# Altium project Leningrad.PrjPcb (part 2 of 2)

## Sheet MemoryControl.SchDoc
size A4
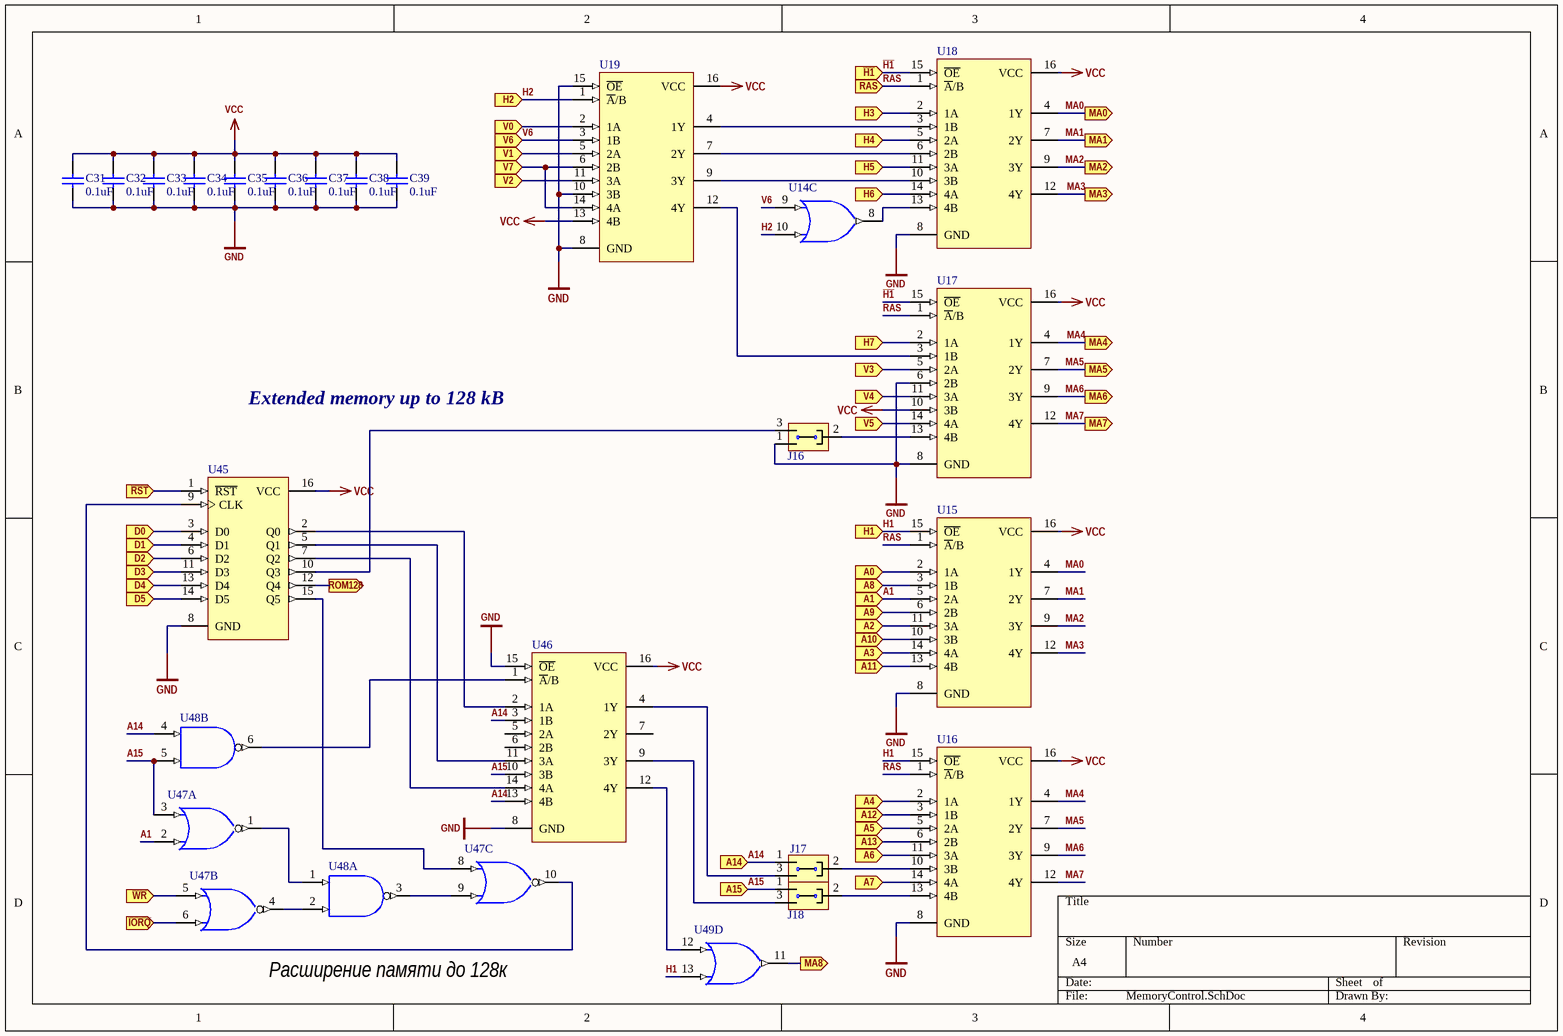
[diagram p6: MemoryControl.SchDoc]

### Parts
C31  value 0.1uF  [RAD-0.3]  (hidden comment: Cap)
C32  value 0.1uF  [RAD-0.3]  (hidden comment: Cap)
C33  value 0.1uF  [RAD-0.3]  (hidden comment: Cap)
C34  value 0.1uF  [RAD-0.3]  (hidden comment: Cap)
C35  value 0.1uF  [RAD-0.3]  (hidden comment: Cap)
C36  value 0.1uF  [RAD-0.3]  (hidden comment: Cap)
C37  value 0.1uF  [RAD-0.3]  (hidden comment: Cap)
C38  value 0.1uF  [RAD-0.3]  (hidden comment: Cap)
C39  value 0.1uF  [RAD-0.3]  (hidden comment: Cap)
J16  Jump3  [MHDR1X3]  (value not drawn)
J17  Jump3  [MHDR1X3]  (value not drawn)
J18  Jump3  [MHDR1X3]  (value not drawn)
U14  (no value)  [N014]  (part C of 4)
U15  (no value)  [N016]
U16  (no value)  [N016]
U17  (no value)  [N016]
U18  (no value)  [N016]
U19  (no value)  [N016]
U45  SN74HC174N  [N016]  (value not drawn)
U46  SN74HC257N  [N016]  (value not drawn)
U47  SN74HC02N  [N014]  (value not drawn)  (parts A,B,C of 4)
U48  SN74HC00N  [N014]  (value not drawn)  (parts A,B of 4)
U49  SN74HC32N  [N014]  (value not drawn)  (part D of 4)

### Ports
A0 (in), A1 (in), A2 (in), A3 (in), A4 (in), A5 (in), A6 (in), A7 (in), A8 (in), A9 (in), A10 (in), A11 (in), A12 (in), A13 (in), A14 (in), A15 (in), D0 (in), D1 (in), D2 (in), D3 (in), D4 (in), D5 (in), H1 (in), H2 (in), H3 (in), H4 (in), H5 (in), H6 (in), H7 (in), MA0 (out), MA1 (out), MA2 (out), MA3 (out), MA4 (out), MA5 (out), MA6 (out), MA7 (out), MA8 (out), RAS (in), ROM128 (out), V0 (in), V1 (in), V2 (in), V3 (in), V4 (in), V5 (in), V6 (in), V7 (in), ~{H1} (in), ~{IORQ} (in), ~{RST} (in), ~{WR} (in)

### Nets
GND: C31.1 C32.1 C33.1 C34.1 C35.1 C36.1 C37.1 C38.1 C39.1 J16.1 U14.7(GND) U15.8(GND) U16.8(GND) U17.6(2B) U17.8(GND) U18.8(GND) U19.8(GND) U19.10(3B) U19.15(~{OE}) U45.8(GND) U46.8(GND) U46.15(~{OE}) U47.7(GND) U48.7(GND) U49.7(GND)
VCC: C31.2 C32.2 C33.2 C34.2 C35.2 C36.2 C37.2 C38.2 C39.2 U14.14(VCC) U15.16(VCC) U16.16(VCC) U17.10(3B) U17.16(VCC) U18.16(VCC) U19.13(4B) U19.16(VCC) U45.16(VCC) U46.16(VCC) U47.14(VCC) U48.14(VCC) U49.14(VCC)
A0: U15.2(1A) ; port A0
A1: U15.5(2A) U47.2(A) ; port A1
A2: U15.11(3A) ; port A2
A3: U15.14(4A) ; port A3
A4: U16.2(1A) ; port A4
A5: U16.5(2A) ; port A5
A6: U16.11(3A) ; port A6
A7: U16.14(4A) ; port A7
A8: U15.3(1B) ; port A8
A9: U15.6(2B) ; port A9
A10: U15.10(3B) ; port A10
A11: U15.13(4B) ; port A11
A12: U16.3(1B) ; port A12
A13: U16.6(2B) ; port A13
A14: J17.1 U46.3(1B) U46.13(4B) U48.4(A) ; port A14
A15: J18.1 U46.10(3B) U47.3(B) U48.5(B) ; port A15
D0: U45.3(D0) ; port D0
D1: U45.4(D1) ; port D1
D2: U45.6(D2) ; port D2
D3: U45.11(D3) ; port D3
D4: U45.13(D4) ; port D4
D5: U45.14(D5) ; port D5
H1: U15.15(~{OE}) U16.15(~{OE}) U49.13(B) ; port H1
H2: U14.10(B) U19.1(~{A}/B) ; port H2
H5: U18.11(3A) ; port H5
~{H1}: U17.15(~{OE}) U18.15(~{OE}) ; port ~{H1}
MA0: U15.4(1Y) U18.4(1Y) ; port MA0
MA1: U15.7(2Y) U18.7(2Y) ; port MA1
MA2: U15.9(3Y) U18.9(3Y) ; port MA2
MA3: U15.12(4Y) U18.12(4Y) ; port MA3
MA4: U16.4(1Y) U17.4(1Y) ; port MA4
MA5: U16.7(2Y) U17.7(2Y) ; port MA5
MA6: U16.9(3Y) U17.9(3Y) ; port MA6
MA7: U16.12(4Y) U17.12(4Y) ; port MA7
MA8: U49.11(Y) ; port MA8
RAS: U15.1(~{A}/B) U16.1(~{A}/B) U17.1(~{A}/B) U18.1(~{A}/B) ; port RAS
V4: U17.11(3A) ; port V4
V5: U17.14(4A) ; port V5
V6: U14.9(A) U19.3(1B) ; port V6
~{WR}: U47.5(A) ; port ~{WR}
NetC1_1: U45.1(~{RST}) ; port ~{RST}
NetJ14_2: U47.6(B) ; port ~{IORQ}
NetJ16_2: J16.2 U17.13(4B)
NetJ16_3: J16.3 U45.10(Q3)
NetJ17_2: J17.2 U16.10(3B)
NetJ17_3: J17.3 U46.4(1Y)
NetJ18_2: J18.2 U16.13(4B)
NetJ18_3: J18.3 U46.9(3Y)
NetJ27_1: U17.2(1A) ; port H7
NetU3_7: U18.2(1A) ; port H3
NetU4_3: U18.5(2A) ; port H4
NetU4_6: U18.14(4A) ; port H6
NetU5_2: U19.5(2A) ; port V1
NetU5_3: U19.2(1A) ; port V0
NetU5_6: U19.11(3A) ; port V2
NetU5_7: U17.5(2A) ; port V3
NetU6_7: U19.6(2B) U19.14(4A) ; port V7
NetU14_8: U14.8(Y) U18.13(4B)
NetU17_3: U17.3(1B) U19.12(4Y)
NetU18_3: U18.3(1B) U19.4(1Y)
NetU18_6: U18.6(2B) U19.7(2Y)
NetU18_10: U18.10(3B) U19.9(3Y)
NetU34_9: U45.12(Q4) ; port ROM128
NetU45_2: U45.2(Q0) U46.2(1A)
NetU45_5: U45.5(Q1) U46.11(3A)
NetU45_7: U45.7(Q2) U46.14(4A)
NetU45_9: U45.9(CLK) U47.10(Y)
NetU45_15: U45.15(Q5) U47.8(A)
NetU46_1: U46.1(~{A}/B) U48.6(Y)
NetU46_12: U46.12(4Y) U49.12(A)
NetU47_1: U47.1(Y) U48.1(A)
NetU47_4: U47.4(Y) U48.2(B)
NetU47_9: U47.9(B) U48.3(Y)

Not connected (* = marked no-connect by the designer): U46 5(2A) 6(2B) 7(2Y)

### Notes on the sheet
- Extended memory up to 128 kB
- Расширение памяти до 128к

### Library data of the parts
C31-C39 = Cap: Capacitor; Published: 8-Jun-2000; LatestRevisionDate: 17-Jul-2002; LatestRevisionNote: Re-released for DXP Platform.; PackageReference: RAD-0.3; Publisher: Altium Limited; PackageDescription: Radial Cap, Thru-Hole; 2 Leads; 0.3 in Pin Spacing
U14 U49 = SN74HC32N: Quadruple 2-Input Positive-OR Gate; Published: 8-Jun-2000; LatestRevisionDate: 04-Mar-2005; LatestRevisionNote: Stylized 3D Model Added.; DatasheetVersion: May-1997; PackageVersion: Oct-1995; PackageReference: N014; Publisher: Altium Limited; PackageDescription: DIP; 14 Leads; Row Spacing 7.62 mm; Pitch 2.54 mm; ComponentLink1Description: Manufacturer Link; ComponentLink1URL: http://www.ti.com/; ComponentLink2Description: Datasheet; ComponentLink2URL: http://www-s.ti.com/sc/ds/sn74hc32.pdf
U15-U19 U46 = SN74HC257N: Quadruple 2-Line to 1-Line Data Selector/Multiplexer with 3-State Outputs; Published: 8-Jun-2000; LatestRevisionDate: 04-Mar-2005; LatestRevisionNote: Stylized 3D Model Added.; DatasheetVersion: Jun-1989; PackageVersion: Oct-1995; PackageReference: N016; Publisher: Altium Limited; PackageDescription: DIP; 16 Leads; Row Spacing 7.62 mm; Pitch 2.54 mm; Code_JEDEC: MS-001-BB; ComponentLink1Description: Manufacturer Link; ComponentLink1URL: http://www.ti.com/; ComponentLink2Description: Datasheet; ComponentLink2URL: http://www-s.ti.com/sc/ds/sn74hc257.pdf
U45 = SN74HC174N: Hex D-Type Flip-Flop with Clear; Published: 8-Jun-2000; LatestRevisionDate: 04-Mar-2005; LatestRevisionNote: Stylized 3D Model Added.; DatasheetVersion: May-1997; PackageVersion: Oct-1995; PackageReference: N016; Publisher: Altium Limited; PackageDescription: DIP; 16 Leads; Row Spacing 7.62 mm; Pitch 2.54 mm; Code_JEDEC: MS-001-BB; ComponentLink1Description: Manufacturer Link; ComponentLink1URL: http://www.ti.com/; ComponentLink2Description: Datasheet; ComponentLink2URL: http://www-s.ti.com/sc/ds/sn74hc174.pdf
U47 = SN74HC02N: Quadruple 2-Input Positive-NOR Gate; Published: 8-Jun-2000; LatestRevisionDate: 04-Mar-2005; LatestRevisionNote: Stylized 3D Model Added.; DatasheetVersion: May-1997; PackageVersion: Oct-1995; PackageReference: N014; Publisher: Altium Limited; PackageDescription: DIP; 14 Leads; Row Spacing 7.62 mm; Pitch 2.54 mm; ComponentLink1Description: Manufacturer Link; ComponentLink1URL: http://www.ti.com/; ComponentLink2Description: Datasheet; ComponentLink2URL: http://www-s.ti.com/sc/ds/sn74hc02.pdf
U48 = SN74HC00N: Quadruple 2-Input Positive-NAND Gate; Published: 8-Jun-2000; LatestRevisionDate: 04-Mar-2005; LatestRevisionNote: Stylized 3D Model Added.; DatasheetVersion: May-1997; PackageVersion: Oct-1995; PackageReference: N014; Publisher: Altium Limited; PackageDescription: DIP; 14 Leads; Row Spacing 7.62 mm; Pitch 2.54 mm; ComponentLink1Description: Manufacturer Link; ComponentLink1URL: http://www.ti.com/; ComponentLink2Description: Datasheet; ComponentLink2URL: http://www-s.ti.com/sc/ds/sn74hc00.pdf

## Sheet RAM.SchDoc
size A4
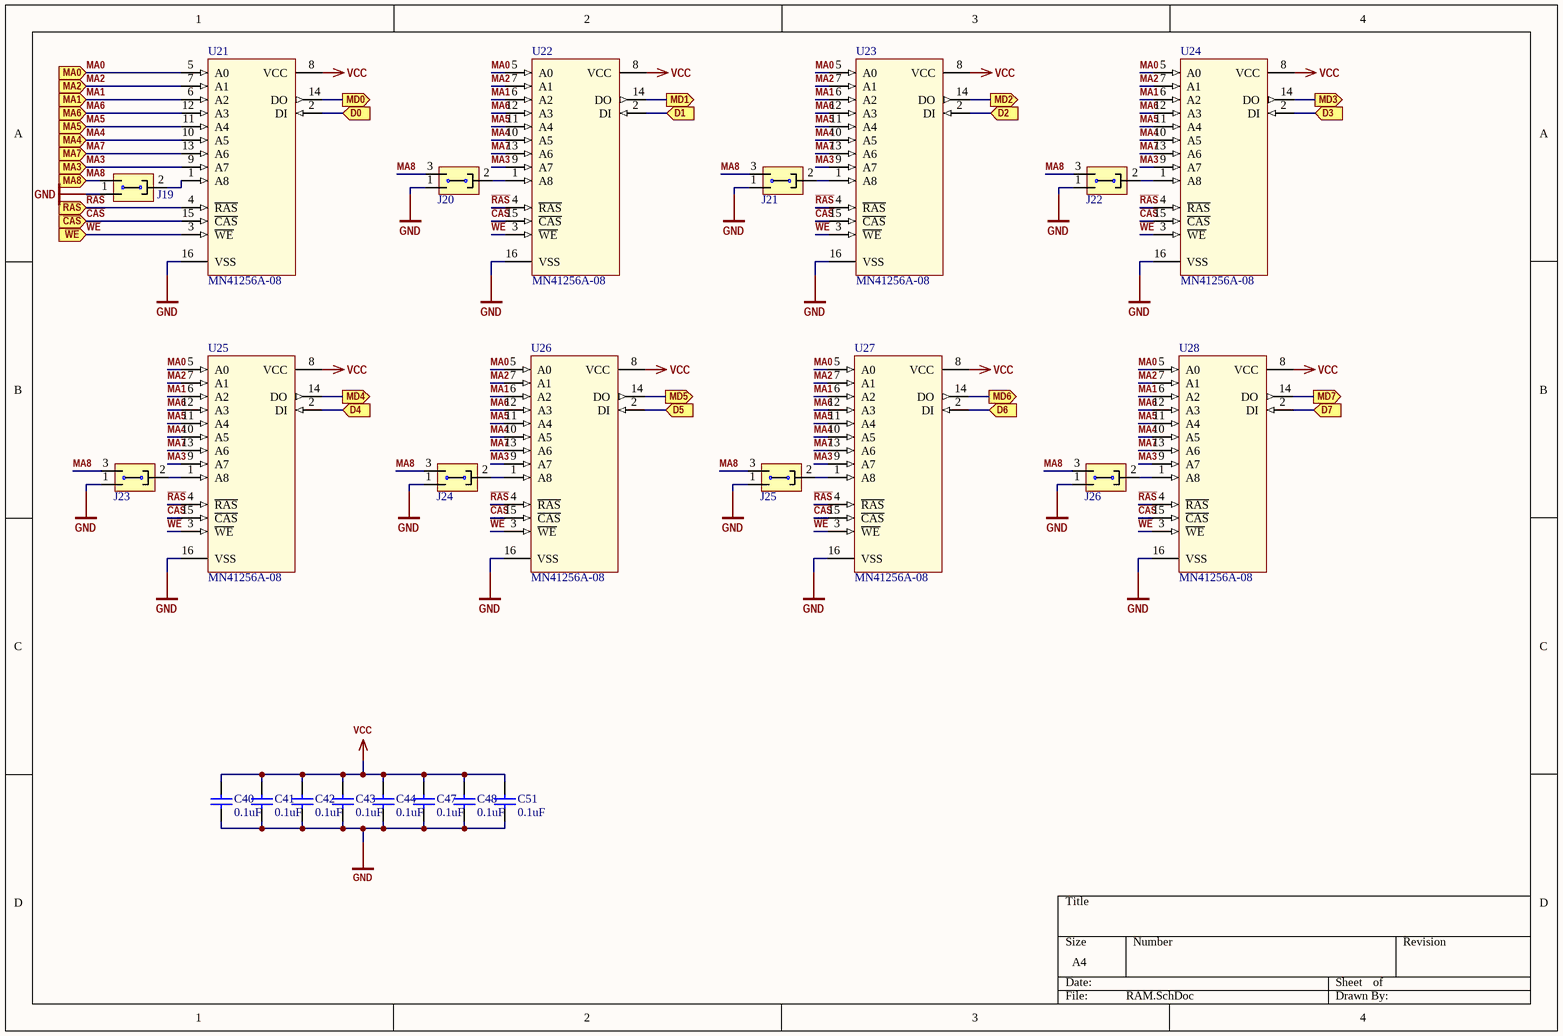
[diagram p7: RAM.SchDoc]

### Parts
C40  value 0.1uF  [RAD-0.3]  (hidden comment: Cap)
C41  value 0.1uF  [RAD-0.3]  (hidden comment: Cap)
C42  value 0.1uF  [RAD-0.3]  (hidden comment: Cap)
C43  value 0.1uF  [RAD-0.3]  (hidden comment: Cap)
C44  value 0.1uF  [RAD-0.3]  (hidden comment: Cap)
C47  value 0.1uF  [RAD-0.3]  (hidden comment: Cap)
C48  value 0.1uF  [RAD-0.3]  (hidden comment: Cap)
C51  value 0.1uF  [RAD-0.3]  (hidden comment: Cap)
J19  Jump3  [MHDR1X3]  (value not drawn)
J20  Jump3  [MHDR1X3]  (value not drawn)
J21  Jump3  [MHDR1X3]  (value not drawn)
J22  Jump3  [MHDR1X3]  (value not drawn)
J23  Jump3  [MHDR1X3]  (value not drawn)
J24  Jump3  [MHDR1X3]  (value not drawn)
J25  Jump3  [MHDR1X3]  (value not drawn)
J26  Jump3  [MHDR1X3]  (value not drawn)
U21  MN41256A-08  [DIP16]
U22  MN41256A-08  [DIP16]
U23  MN41256A-08  [DIP16]
U24  MN41256A-08  [DIP16]
U25  MN41256A-08  [DIP16]
U26  MN41256A-08  [DIP16]
U27  MN41256A-08  [DIP16]
U28  MN41256A-08  [DIP16]

### Ports
D0 (in), D1 (in), D2 (in), D3 (in), D4 (in), D5 (in), D6 (in), D7 (in), MA0 (in), MA1 (in), MA2 (in), MA3 (in), MA4 (in), MA5 (in), MA6 (in), MA7 (in), MA8 (in), MD0 (out), MD1 (out), MD2 (out), MD3 (out), MD4 (out), MD5 (out), MD6 (out), MD7 (out), ~{CAS} (in), ~{RAS} (in), ~{WE} (in)

### Nets
GND: C40.1 C41.1 C42.1 C43.1 C44.1 C47.1 C48.1 C51.1 J19.1 J20.1 J21.1 J22.1 J23.1 J24.1 J25.1 J26.1 U21.16(VSS) U22.16(VSS) U23.16(VSS) U24.16(VSS) U25.16(VSS) U26.16(VSS) U27.16(VSS) U28.16(VSS)
VCC: C40.2 C41.2 C42.2 C43.2 C44.2 C47.2 C48.2 C51.2 U21.8(VCC) U22.8(VCC) U23.8(VCC) U24.8(VCC) U25.8(VCC) U26.8(VCC) U27.8(VCC) U28.8(VCC)
~{CAS}: U21.15(~{CAS}) U22.15(~{CAS}) U23.15(~{CAS}) U24.15(~{CAS}) U25.15(~{CAS}) U26.15(~{CAS}) U27.15(~{CAS}) U28.15(~{CAS}) ; port ~{CAS}
D0: U21.2(DI) ; port D0
D1: U22.2(DI) ; port D1
D2: U23.2(DI) ; port D2
D3: U24.2(DI) ; port D3
D4: U25.2(DI) ; port D4
D5: U26.2(DI) ; port D5
D6: U27.2(DI) ; port D6
D7: U28.2(DI) ; port D7
MA0: U21.5(A0) U22.5(A0) U23.5(A0) U24.5(A0) U25.5(A0) U26.5(A0) U27.5(A0) U28.5(A0) ; port MA0
MA1: U21.6(A2) U22.6(A2) U23.6(A2) U24.6(A2) U25.6(A2) U26.6(A2) U27.6(A2) U28.6(A2) ; port MA1
MA2: U21.7(A1) U22.7(A1) U23.7(A1) U24.7(A1) U25.7(A1) U26.7(A1) U27.7(A1) U28.7(A1) ; port MA2
MA3: U21.9(A7) U22.9(A7) U23.9(A7) U24.9(A7) U25.9(A7) U26.9(A7) U27.9(A7) U28.9(A7) ; port MA3
MA4: U21.10(A5) U22.10(A5) U23.10(A5) U24.10(A5) U25.10(A5) U26.10(A5) U27.10(A5) U28.10(A5) ; port MA4
MA5: U21.11(A4) U22.11(A4) U23.11(A4) U24.11(A4) U25.11(A4) U26.11(A4) U27.11(A4) U28.11(A4) ; port MA5
MA6: U21.12(A3) U22.12(A3) U23.12(A3) U24.12(A3) U25.12(A3) U26.12(A3) U27.12(A3) U28.12(A3) ; port MA6
MA7: U21.13(A6) U22.13(A6) U23.13(A6) U24.13(A6) U25.13(A6) U26.13(A6) U27.13(A6) U28.13(A6) ; port MA7
MA8: J19.3 J20.3 J21.3 J22.3 J23.3 J24.3 J25.3 J26.3 ; port MA8
MD0: U21.14(DO) ; port MD0
MD1: U22.14(DO) ; port MD1
MD2: U23.14(DO) ; port MD2
MD3: U24.14(DO) ; port MD3
MD4: U25.14(DO) ; port MD4
MD5: U26.14(DO) ; port MD5
MD6: U27.14(DO) ; port MD6
MD7: U28.14(DO) ; port MD7
~{RAS}: U21.4(~{RAS}) U22.4(~{RAS}) U23.4(~{RAS}) U24.4(~{RAS}) U25.4(~{RAS}) U26.4(~{RAS}) U27.4(~{RAS}) U28.4(~{RAS}) ; port ~{RAS}
~{WE}: U21.3(~{WE}) U22.3(~{WE}) U23.3(~{WE}) U24.3(~{WE}) U25.3(~{WE}) U26.3(~{WE}) U27.3(~{WE}) U28.3(~{WE}) ; port ~{WE}
NetJ19_2: J19.2 U21.1(A8)
NetJ20_2: J20.2 U22.1(A8)
NetJ21_2: J21.2 U23.1(A8)
NetJ22_2: J22.2 U24.1(A8)
NetJ23_2: J23.2 U25.1(A8)
NetJ24_2: J24.2 U26.1(A8)
NetJ25_2: J25.2 U27.1(A8)
NetJ26_2: J26.2 U28.1(A8)

### Library data of the parts
C40-C44 C47 C48 C51 = Cap: Capacitor; Published: 8-Jun-2000; LatestRevisionDate: 17-Jul-2002; LatestRevisionNote: Re-released for DXP Platform.; PackageReference: RAD-0.3; Publisher: Altium Limited; PackageDescription: Radial Cap, Thru-Hole; 2 Leads; 0.3 in Pin Spacing

## Sheet Keyboard.SchDoc
size A4
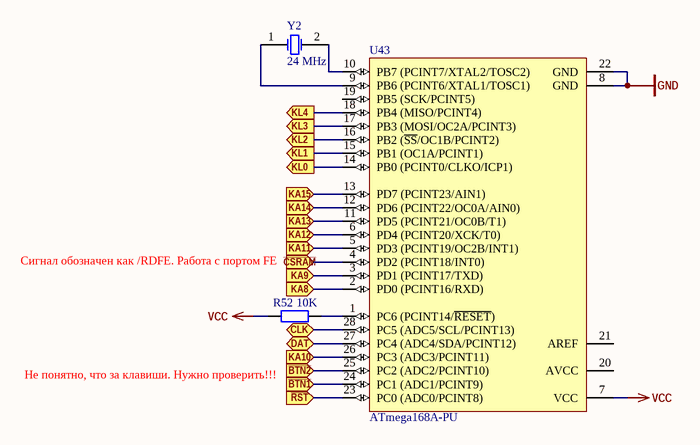
[diagram p8: Keyboard.SchDoc]

### Parts
R52  value 10K  [AXIAL-0.4]  (hidden comment: Res2)
U43  ATmega168A-PU  [28P3]
Y2  24 MHz  [HC25U]

### Ports
CLK (bidir), DAT (bidir), KA8 (in), KA9 (in), KA10 (in), KA11 (in), KA12 (in), KA13 (in), KA14 (in), KA15 (in), KL0 (out), KL1 (out), KL2 (out), KL3 (out), KL4 (out), ~{BTN1} (in), ~{BTN2} (in), ~{CSRAM} (in), ~{RST} (in)

### Nets
GND: U43.8(GND) U43.22(GND)
VCC: R52.2 U43.7(VCC)
KL0: U43.14(PB0_(PCINT0/CLKO/ICP1)) ; port KL0
KL1: U43.15(PB1_(OC1A/PCINT1)) ; port KL1
KL2: U43.16(PB2_(~{SS}/OC1B/PCINT2)) ; port KL2
KL3: U43.17(PB3_(MOSI/OC2A/PCINT3)) ; port KL3
KL4: U43.18(PB4_(MISO/PCINT4)) ; port KL4
NetBTN1_1: U43.24(PC1_(ADC1/PCINT9)) ; port ~{BTN1}
NetBTN2_1: U43.25(PC2_(ADC2/PCINT10)) ; port ~{BTN2}
NetC1_1: U43.23(PC0_(ADC0/PCINT8)) ; port ~{RST}
NetD10_1: U43.2(PD0_(PCINT16/RXD)) ; port KA8
NetD11_1: U43.3(PD1_(PCINT17/TXD)) ; port KA9
NetD12_1: U43.26(PC3_(ADC3/PCINT11)) ; port KA10
NetD13_1: U43.5(PD3_(PCINT19/OC2B/INT1)) ; port KA11
NetD14_1: U43.6(PD4_(PCINT20/XCK/T0)) ; port KA12
NetD15_1: U43.11(PD5_(PCINT21/OC0B/T1)) ; port KA13
NetD16_1: U43.12(PD6_(PCINT22/OC0A/AIN0)) ; port KA14
NetD17_1: U43.13(PD7_(PCINT23/AIN1)) ; port KA15
NetR52_1: R52.1 U43.1(PC6_(PCINT14/~{RESET}))
NetU1_9: U43.4(PD2_(PCINT18/INT0)) ; port ~{CSRAM}
NetU43_9: U43.9(PB6_(PCINT6/XTAL1/TOSC1)) Y2.1(OSC1)
NetU43_10: U43.10(PB7_(PCINT7/XTAL2/TOSC2)) Y2.2(OSC2)
NetU43_27: U43.27(PC4_(ADC4/SDA/PCINT12)) ; port DAT
NetU43_28: U43.28(PC5_(ADC5/SCL/PCINT13)) ; port CLK

Not connected (* = marked no-connect by the designer): U43 19(PB5_(SCK/PCINT5)) 20(AVCC) 21(AREF)

### Notes on the sheet
- Сигнал обозначен как /RDFE. Работа с портом FE
- Не понятно, что за клавиши. Нужно проверить!!!

### Library data of the parts
R52 = Res2: Resistor; Published: 8-Jun-2000; LatestRevisionDate: 17-Jul-2002; LatestRevisionNote: Re-released for DXP Platform.; PackageReference: AXIAL-0.4; Publisher: Altium Limited; PackageDescription: Axial Device, Thru-Hole; 2 Leads; 0.4 in Pin Spacing
U43 = ATmega168A-PU: 8-bit AVR Microcontroller, 16KB Flash, 512 Bytes EEPROM, 1KB SRAM, 28-pin PDIP, Industrial Grade (-40°C to 85°C); Published: 1-Apr-2010; DatasheetVersion: revA, Jan-2010; PackageVersion: revB, Sep-2001; PackageReference: 28P3; Publisher: Altium Limited; PackageDescription: 28-lead (0.300"/7.62mm Wide) Plastic Dual Inline Package (PDIP); Supplier 1: Digi-Key; Supplier Part Number 1: ATMEGA168A-PU-ND; Supplier 2: Mouser; Supplier Part Number 2: 556-ATMEGA168A-PU; ComponentLink1Description: Manufacturer Link; ComponentLink1URL: http://www.atmel.com/products/avr/default.asp?; ComponentLink2Description: ATmega48A/48PA/88A/88PA/168A/168PA/328/328P Datasheet; ComponentLink2URL: http://www.atmel.com/dyn/resources/prod_documents/8271.pdf; ComponentLink3Description: ATmega48A/48PA/88A/88PA/168A/168PA/328/328P Summary; ComponentLink3URL: http://www.atmel.com/dyn/resources/prod_documents/8271S.pdf; ComponentLink4Description: Atmel.com Home; ComponentLink4URL: http://www.atmel.com
Y2 = XTAL: Crystal Oscillator; Published: 8-Jun-2000; LatestRevisionDate: 17-Jul-2002; LatestRevisionNote: Re-released for DXP Platform.; PackageReference: R38; Publisher: Altium Limited; PackageDescription: Crystal, Thru-Hole; 2 Leads; Body 3.1 x 8.2 mm (Dia.xH)

## Sheet AudioAY.SchDoc
size A4
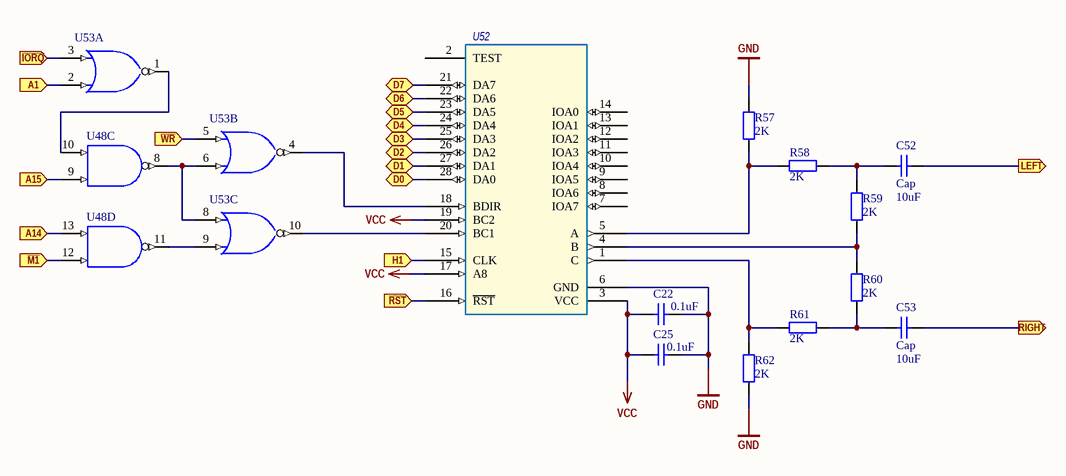
[diagram p9: AudioAY.SchDoc]

### Parts
C22  value 0.1uF  [RAD-0.3]  (hidden comment: Cap)
C25  value 0.1uF  [RAD-0.3]  (hidden comment: Cap)
C52  Cap  value 10uF  [RAD-0.3]
C53  Cap  value 10uF  [RAD-0.3]
R57  value 2K  [AXIAL-0.4]  (hidden comment: Res2)
R58  value 2K  [AXIAL-0.4]  (hidden comment: Res2)
R59  value 2K  [AXIAL-0.4]  (hidden comment: Res2)
R60  value 2K  [AXIAL-0.4]  (hidden comment: Res2)
R61  value 2K  [AXIAL-0.4]  (hidden comment: Res2)
R62  value 2K  [AXIAL-0.4]  (hidden comment: Res2)
U48  SN74HC00N  [N014]  (value not drawn)  (parts C,D of 4)
U52  AY-3-8912  [FDIP28W]  (value not drawn)
U53  SN74HC02N  [N014]  (value not drawn)  (parts A,B,C of 4)

### Ports
A1 (in), A14 (in), A15 (in), D0 (bidir), D1 (bidir), D2 (bidir), D3 (bidir), D4 (bidir), D5 (bidir), D6 (bidir), D7 (bidir), H1 (in), LEFT (out), RIGHT (out), ~{IORQ} (in), ~{M1} (in), ~{RST} (in), ~{WR} (in)

### Nets
GND: C22.2 C25.2 R57.2 R62.1 U48.7(GND) U52.6(GND) U53.7(GND)
VCC: C22.1 C25.1 U48.14(VCC) U52.3(VCC) U52.17(A8) U52.19(BC2) U53.14(VCC)
A1: U53.2(A) ; port A1
A14: U48.13(B) ; port A14
A15: U48.9(A) ; port A15
D0: U52.28(DA0) ; port D0
D1: U52.27(DA1) ; port D1
D2: U52.26(DA2) ; port D2
D3: U52.25(DA3) ; port D3
D4: U52.24(DA4) ; port D4
D5: U52.23(DA5) ; port D5
D6: U52.22(DA6) ; port D6
D7: U52.21(DA7) ; port D7
H1: U52.15(CLK) ; port H1
~{WR}: U53.5(A) ; port ~{WR}
NetC1_1: U52.16(~{RST}) ; port ~{RST}
NetC52_1: C52.1 R58.2 R59.2
NetC52_2: C52.2 ; port LEFT
NetC53_1: C53.1 R60.1 R61.2
NetC53_2: C53.2 ; port RIGHT
NetJ14_2: U53.3(B) ; port ~{IORQ}
NetR57_1: R57.1 R58.1 U52.5(A)
NetR59_1: R59.1 R60.2 U52.4(B)
NetR61_1: R61.1 R62.2 U52.1(C)
NetU9_2: U48.12(A) ; port ~{M1}
NetU48_8: U48.8(Y) U53.6(B) U53.8(A)
NetU48_10: U48.10(B) U53.1(Y)
NetU48_11: U48.11(Y) U53.9(B)
NetU52_18: U52.18(BDIR) U53.4(Y)
NetU52_20: U52.20(BC1) U53.10(Y)

Not connected (* = marked no-connect by the designer): U52 2(TEST) 7(IOA7) 8(IOA6) 9(IOA5) 10(IOA4) 11(IOA3) 12(IOA2) 13(IOA1) 14(IOA0)

### Library data of the parts
C22 C25 C52 C53 = Cap: Capacitor; Published: 8-Jun-2000; LatestRevisionDate: 17-Jul-2002; LatestRevisionNote: Re-released for DXP Platform.; PackageReference: RAD-0.3; Publisher: Altium Limited; PackageDescription: Radial Cap, Thru-Hole; 2 Leads; 0.3 in Pin Spacing
R57-R62 = Res2: Resistor; Published: 8-Jun-2000; LatestRevisionDate: 17-Jul-2002; LatestRevisionNote: Re-released for DXP Platform.; PackageReference: AXIAL-0.4; Publisher: Altium Limited; PackageDescription: Axial Device, Thru-Hole; 2 Leads; 0.4 in Pin Spacing
U48 = SN74HC00N: Quadruple 2-Input Positive-NAND Gate; Published: 8-Jun-2000; LatestRevisionDate: 04-Mar-2005; LatestRevisionNote: Stylized 3D Model Added.; DatasheetVersion: May-1997; PackageVersion: Oct-1995; PackageReference: N014; Publisher: Altium Limited; PackageDescription: DIP; 14 Leads; Row Spacing 7.62 mm; Pitch 2.54 mm; ComponentLink1Description: Manufacturer Link; ComponentLink1URL: http://www.ti.com/; ComponentLink2Description: Datasheet; ComponentLink2URL: http://www-s.ti.com/sc/ds/sn74hc00.pdf
U53 = SN74HC02N: Quadruple 2-Input Positive-NOR Gate; Published: 8-Jun-2000; LatestRevisionDate: 04-Mar-2005; LatestRevisionNote: Stylized 3D Model Added.; DatasheetVersion: May-1997; PackageVersion: Oct-1995; PackageReference: N014; Publisher: Altium Limited; PackageDescription: DIP; 14 Leads; Row Spacing 7.62 mm; Pitch 2.54 mm; ComponentLink1Description: Manufacturer Link; ComponentLink1URL: http://www.ti.com/; ComponentLink2Description: Datasheet; ComponentLink2URL: http://www-s.ti.com/sc/ds/sn74hc02.pdf

## Sheet Interface.SchDoc
size A4
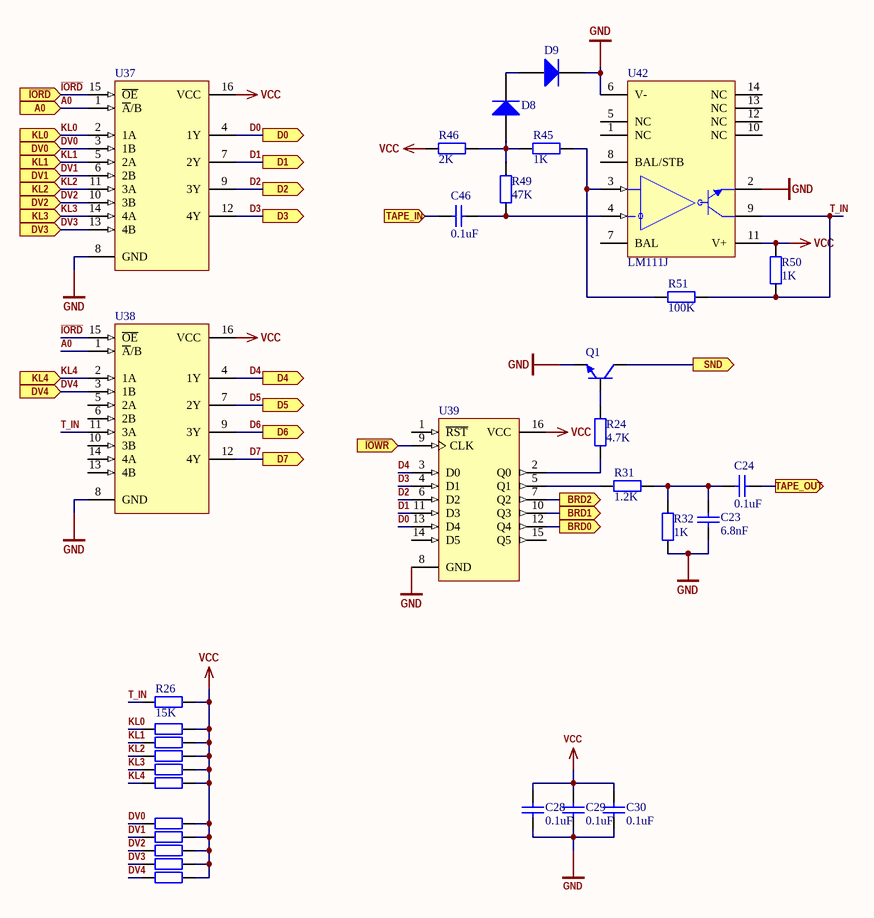
[diagram p10: Interface.SchDoc]

### Parts
C23  value 6.8nF  [RAD-0.3]  (hidden comment: Cap)
C24  value 0.1uF  [RAD-0.3]  (hidden comment: Cap)
C28  value 0.1uF  [RAD-0.3]  (hidden comment: Cap)
C29  value 0.1uF  [RAD-0.3]  (hidden comment: Cap)
C30  value 0.1uF  [RAD-0.3]  (hidden comment: Cap)
C46  value 0.1uF  [RAD-0.3]  (hidden comment: Cap)
D8  Diode 1N4148  [DO-35]  (value not drawn)
D9  Diode 1N4148  [DO-35]  (value not drawn)
Q1  KT315  [D35]  (value not drawn)
R24  value 4.7K  [AXIAL-0.4]  (hidden comment: Res2)
R26  value 15K  [AXIAL-0.4]  (hidden comment: Res2)
R27  Res2  [AXIAL-0.4]  (value not drawn)
R28  Res2  [AXIAL-0.4]  (value not drawn)
R29  Res2  [AXIAL-0.4]  (value not drawn)
R30  Res2  [AXIAL-0.4]  (value not drawn)
R31  value 1.2K  [AXIAL-0.4]  (hidden comment: Res2)
R32  value 1K  [AXIAL-0.4]  (hidden comment: Res2)
R33  Res2  [AXIAL-0.4]  (value not drawn)
R36  Res2  [AXIAL-0.4]  (value not drawn)
R38  Res2  [AXIAL-0.4]  (value not drawn)
R40  Res2  [AXIAL-0.4]  (value not drawn)
R42  Res2  [AXIAL-0.4]  (value not drawn)
R44  Res2  [AXIAL-0.4]  (value not drawn)
R45  value 1K  [AXIAL-0.4]  (hidden comment: Res2)
R46  value 2K  [AXIAL-0.4]  (hidden comment: Res2)
R49  value 47K  [AXIAL-0.4]  (hidden comment: Res2)
R50  value 1K  [AXIAL-0.4]  (hidden comment: Res2)
R51  value 100K  [AXIAL-0.4]  (hidden comment: Res2)
U37  (no value)  [N016]
U38  (no value)  [N016]
U39  (no value)  [N016]
U42  LM111J  [J014]

### Ports
A0 (in), BRD0 (out), BRD1 (out), BRD2 (out), D0 (out), D1 (out), D2 (out), D3 (out), D4 (out), D5 (out), D6 (out), D7 (out), DV0 (in), DV1 (in), DV2 (in), DV3 (in), DV4 (in), KL0 (in), KL1 (in), KL2 (in), KL3 (in), KL4 (in), SND (out), TAPE_IN (in), TAPE_OUT (out), ~{IORD} (in), ~{IOWR} (in)

### Nets
GND: C23.1 C28.1 C29.1 C30.1 D9.2(K) Q1.1(E) R32.1 U37.8(GND) U38.8(GND) U39.8(GND) U42.2(EM_OUT) U42.6(V-)
VCC: C28.2 C29.2 C30.2 R26.2 R27.2 R28.2 R29.2 R30.2 R33.2 R36.2 R38.2 R40.2 R42.2 R44.2 R46.2 R50.2 U37.16(VCC) U38.16(VCC) U39.16(VCC) U42.11(V+)
A0: U37.1(~{A}/B) U38.1(~{A}/B) ; port A0
BRD0: U39.12(Q4) ; port BRD0
BRD1: U39.10(Q3) ; port BRD1
BRD2: U39.7(Q2) ; port BRD2
D0: U37.4(1Y) U39.13(D4) ; port D0
D1: U37.7(2Y) U39.11(D3) ; port D1
D2: U37.9(3Y) U39.6(D2) ; port D2
D3: U37.12(4Y) U39.4(D1) ; port D3
D4: U38.4(1Y) U39.3(D0) ; port D4
D5: U38.7(2Y) ; port D5
D6: U38.9(3Y) ; port D6
D7: U38.12(4Y) ; port D7
DV0: R36.1 U37.3(1B) ; port DV0
DV1: R38.1 U37.6(2B) ; port DV1
DV2: R40.1 U37.10(3B) ; port DV2
DV3: R42.1 U37.13(4B) ; port DV3
DV4: R44.1 U38.3(1B) ; port DV4
~{IORD}: U37.15(~{OE}) U38.15(~{OE}) ; port ~{IORD}
KL0: R27.1 U37.2(1A) ; port KL0
KL1: R28.1 U37.5(2A) ; port KL1
KL2: R29.1 U37.11(3A) ; port KL2
KL3: R30.1 U37.14(4A) ; port KL3
KL4: R33.1 U38.2(1A) ; port KL4
T_IN: R26.1 R50.1 R51.1 U38.11(3A) U42.9(COL_OUT)
NetC23_2: C23.2 C24.2 R31.2 R32.2
NetC24_1: C24.1 ; port TAPE_OUT
NetC46_1: C46.1 ; port TAPE_IN
NetC46_2: C46.2 R49.1 U42.4(IN-)
NetD8_1: D8.1(A) R45.2 R46.1 R49.2
NetD8_2: D8.2(K) D9.1(A)
NetJ6_2: U39.9(CLK) ; port ~{IOWR}
NetQ1_2: Q1.2(C) ; port SND
NetQ1_3: Q1.3(B) R24.2
NetR24_1: R24.1 U39.2(Q0)
NetR31_1: R31.1 U39.5(Q1)
NetR45_1: R45.1 R51.2 U42.3(IN+)

Not connected (* = marked no-connect by the designer): U38 5(2A) 6(2B) 10(3B) 13(4B) 14(4A); U39 1(~{RST}) 14(D5) 15(Q5); U42 1(NC) 5(NC) 7(BAL) 8(BAL/STB) 10(NC) 12(NC) 13(NC) 14(NC)

### Library data of the parts
C23 C24 C28-C30 C46 = Cap: Capacitor; Published: 8-Jun-2000; LatestRevisionDate: 17-Jul-2002; LatestRevisionNote: Re-released for DXP Platform.; PackageReference: RAD-0.3; Publisher: Altium Limited; PackageDescription: Radial Cap, Thru-Hole; 2 Leads; 0.3 in Pin Spacing
D8 D9 = Diode 1N4148: High Conductance Fast Diode; Published: 8-Jun-2000; LatestRevisionDate: 17-Jul-2002; LatestRevisionNote: Re-released for DXP Platform.; DatasheetVersion: 1997; PackageReference: DO-35; Publisher: Altium Limited; PackageDescription: Diode, Axial; Body 3.8 x 1.9 mm (LxDia. max), Lead Dia. 0.53 mm (max); Code_JEDEC: DO-204-AH; ComponentLink1Description: Manufacturer Link; ComponentLink1URL: http://www.fairchildsemi.com/; ComponentLink2Description: Datasheet; ComponentLink2URL: http://www.fairchildsemi.com/ds/1N%2F1N4148.pdf
Q1 = KT315: NPN General Purpose Amplifier; Published: 8-Jun-2000; LatestRevisionDate: 15-Jan-2003; LatestRevisionNote: PCB Footprint 'BCY-W3/D4.7' replaced; DatasheetVersion: 1997; PackageVersion: Sep-1998; PackageReference: TO-92A; Publisher: Altium Limited; PackageDescription: TO, Flat Index; 3 In-Line, Axial Leads; Body Dia. 4.5mm; Leads 0.51 x 0.48 mm (max); ComponentLink1Description: Manufacturer Link; ComponentLink1URL: http://www.fairchildsemi.com/; ComponentLink2Description: Datasheet; ComponentLink2URL: http://www.fairchildsemi.com/ds/2N%2F2N3904.pdf
R24 R26 R31 R32 R45 R46 R49-R51 = Res2: Resistor; Published: 8-Jun-2000; LatestRevisionDate: 17-Jul-2002; LatestRevisionNote: Re-released for DXP Platform.; PackageReference: AXIAL-0.4; Publisher: Altium Limited; PackageDescription: Axial Device, Thru-Hole; 2 Leads; 0.4 in Pin Spacing
R27-R30 R33 R36 R38 R40 R42 R44 = Res2: Resistor; Value: 15K; Published: 8-Jun-2000; LatestRevisionDate: 17-Jul-2002; LatestRevisionNote: Re-released for DXP Platform.; PackageReference: AXIAL-0.4; Publisher: Altium Limited; PackageDescription: Axial Device, Thru-Hole; 2 Leads; 0.4 in Pin Spacing
U37 U38 = SN74HC257N: as U15 on sheet MemoryControl; Published: 8-Jun-2000; LatestRevisionDate: 04-Mar-2005; LatestRevisionNote: Stylized 3D Model Added.; DatasheetVersion: Jun-1989; PackageVersion: Oct-1995; PackageReference: N016; Publisher: Altium Limited; PackageDescription: DIP; 16 Leads; Row Spacing 7.62 mm; Pitch 2.54 mm; Code_JEDEC: MS-001-BB; ComponentLink1Description: Manufacturer Link; ComponentLink1URL: http://www.ti.com/; ComponentLink2Description: Datasheet; ComponentLink2URL: http://www-s.ti.com/sc/ds/sn74hc257.pdf
U39 = SN74HC174N: Hex D-Type Flip-Flop with Clear; Published: 8-Jun-2000; LatestRevisionDate: 04-Mar-2005; LatestRevisionNote: Stylized 3D Model Added.; DatasheetVersion: May-1997; PackageVersion: Oct-1995; PackageReference: N016; Publisher: Altium Limited; PackageDescription: DIP; 16 Leads; Row Spacing 7.62 mm; Pitch 2.54 mm; Code_JEDEC: MS-001-BB; ComponentLink1Description: Manufacturer Link; ComponentLink1URL: http://www.ti.com/; ComponentLink2Description: Datasheet; ComponentLink2URL: http://www-s.ti.com/sc/ds/sn74hc174.pdf
U42 = LM111J: Differential Comparator with Strobe; Note: Pins 1, 5, 10, 12, 13 and 14 are NC pins.; Published: 16-Jan-2001; LatestRevisionDate: 20-Jul-2007; LatestRevisionNote: Sch Symbol changed.; DatasheetVersion: Feb-1992; PackageVersion: Jun-1999; PackageReference: J014; Publisher: Altium Limited; PackageDescription: DIP; 14 Leads; Row Spacing 7.62 mm; Pitch 2.54 mm; ComponentLink1Description: Manufacturer Link; ComponentLink1URL: http://www.ti.com/; ComponentLink2Description: Datasheet; ComponentLink2URL: http://www-s.ti.com/sc/ds/lm111.pdf

## Sheet Connectors.SchDoc
size A4
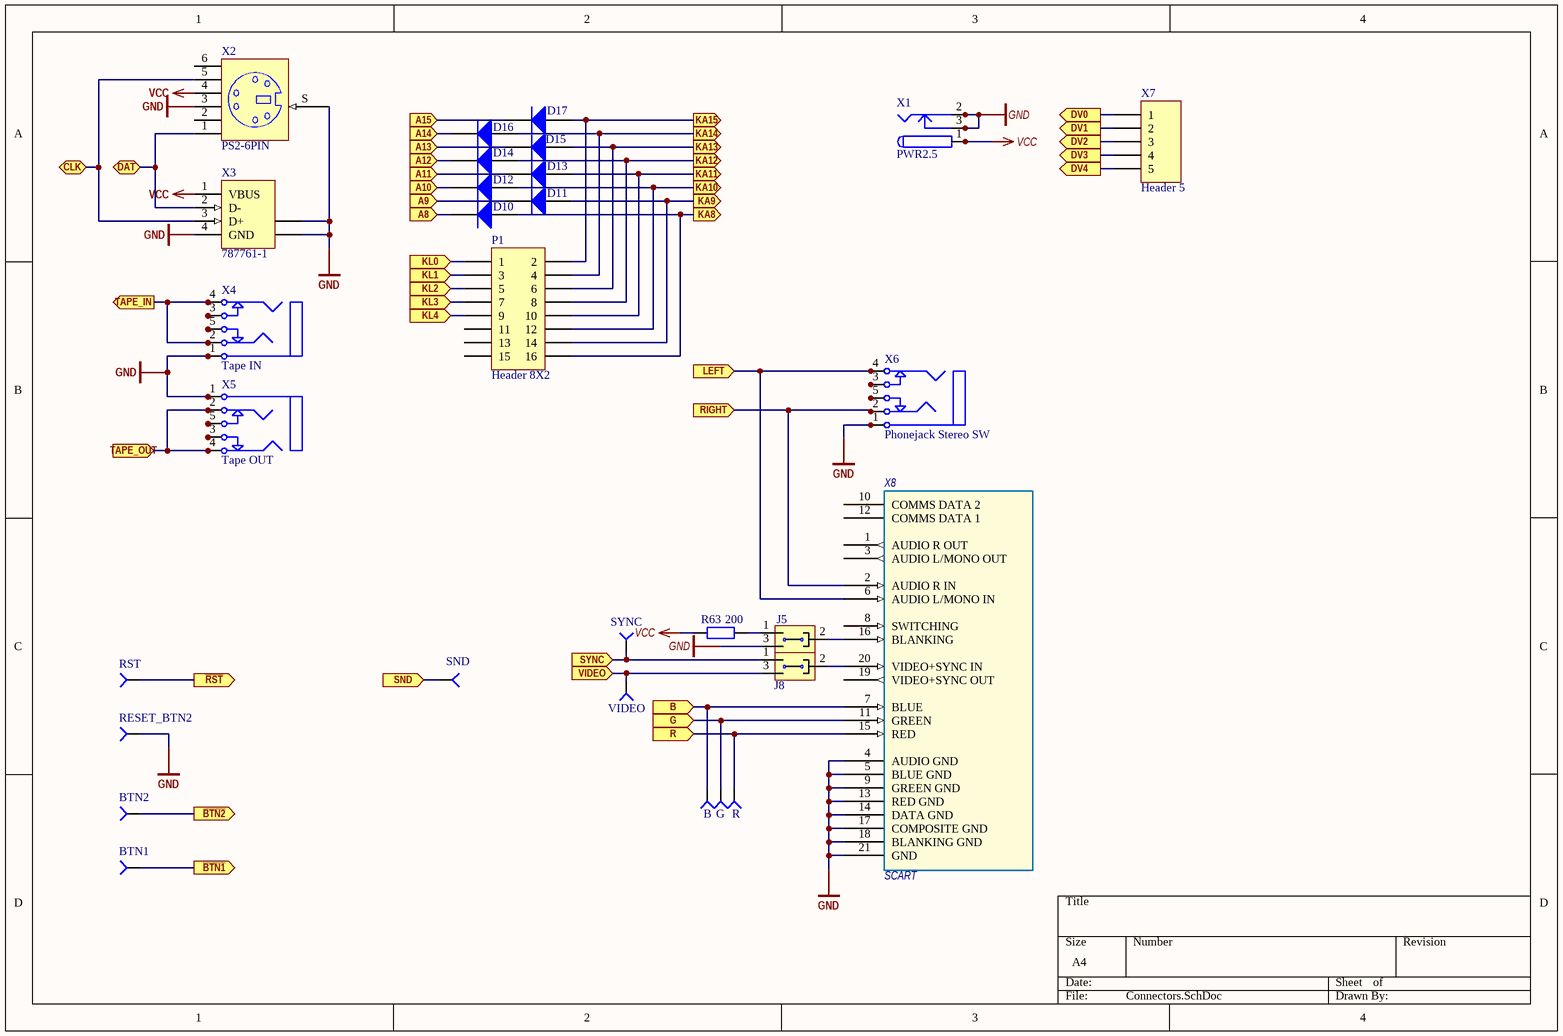
[diagram p11: Connectors.SchDoc]

### Parts
B  (no value)  [PIN1]
BTN1  Socket  [PIN1]  (value not drawn)
BTN2  Socket  [PIN1]  (value not drawn)
D10  Diode 1N4148  [DO-35]  (value not drawn)
D11  Diode 1N4148  [DO-35]  (value not drawn)
D12  Diode 1N4148  [DO-35]  (value not drawn)
D13  Diode 1N4148  [DO-35]  (value not drawn)
D14  Diode 1N4148  [DO-35]  (value not drawn)
D15  Diode 1N4148  [DO-35]  (value not drawn)
D16  Diode 1N4148  [DO-35]  (value not drawn)
D17  Diode 1N4148  [DO-35]  (value not drawn)
G  (no value)  [PIN1]
J5  Jump3  [MHDR1X3]  (value not drawn)
J8  Jump3  [MHDR1X3]  (value not drawn)
P1  Header 8X2  [HDR2X8]
R  (no value)  [PIN1]
R63  value 200  [AXIAL-0.4]  (hidden comment: Res2)
RESET_BTN2  (no value)  [PIN1]
RST  (no value)  [PIN1]
SND  (no value)  [PIN1]
SYNC  (no value)  [PIN1]
VIDEO  (no value)  [PIN1]
X1  PWR2.5  [KLD-0202]
X2  PS2-6PIN  [PS2-6PIN]
X3  787761-1  [787761]
X4  Tape IN  [ST-3150-5N]
X5  Tape OUT  [ST-3150-5N]
X6  Phonejack Stereo SW  [ST-3150-5N]
X7  Header 5  [HDR1X5]
X8  SCART  [SCART]

### Ports
A8 (in), A9 (in), A10 (in), A11 (in), A12 (in), A13 (in), A14 (in), A15 (in), B (in), CLK (bidir), DAT (bidir), DV0 (out), DV1 (out), DV2 (out), DV3 (out), DV4 (out), G (in), KA8 (out), KA9 (out), KA10 (out), KA11 (out), KA12 (out), KA13 (out), KA14 (out), KA15 (out), KL0 (in), KL1 (in), KL2 (in), KL3 (in), KL4 (in), LEFT (in), R (in), RIGHT (in), SND (in), SYNC (in), TAPE_IN (out), TAPE_OUT (in), VIDEO (in), ~{BTN1} (out), ~{BTN2} (out), ~{RST} (out)

### Nets
GND: J5.3 RESET_BTN2.1 X1.2 X1.2A X1.2B X1.3 X1.3A X1.3B X2.3 X2.S X3.4(GND) X3.5(SHLD) X3.6(SHLD) X4.1 X4.1A X4.1B X5.1 X5.1A X5.1B X6.1 X6.1A X6.1B X8.4(AUDIO_GND) X8.5(BLUE_GND) X8.9(GREEN_GND) X8.13(RED_GND) X8.14(DATA_GND) X8.17(COMPOSITE_GND) X8.18(BLANKING_GND) X8.21(GND)
VCC: R63.1 X1.1 X1.1A X1.1B X2.4 X3.1(VBUS)
A8: D10.2(K) ; port A8
A9: D11.2(K) ; port A9
A10: D12.2(K) ; port A10
A11: D13.2(K) ; port A11
A12: D14.2(K) ; port A12
A13: D15.2(K) ; port A13
A14: D16.2(K) ; port A14
A15: D17.2(K) ; port A15
DV0: X7.1 ; port DV0
DV1: X7.2 ; port DV1
DV2: X7.3 ; port DV2
DV3: X7.4 ; port DV3
DV4: X7.5 ; port DV4
KL0: P1.1 ; port KL0
KL1: P1.3 ; port KL1
KL2: P1.5 ; port KL2
KL3: P1.7 ; port KL3
KL4: P1.9 ; port KL4
NetB_1: B.1 X8.7(BLUE) ; port B
NetBTN1_1: BTN1.1 ; port ~{BTN1}
NetBTN2_1: BTN2.1 ; port ~{BTN2}
NetC1_1: RST.1 ; port ~{RST}
NetC24_1: X5.2 X5.2A X5.2B X5.4 X5.4A X5.4B ; port TAPE_OUT
NetC46_1: X4.2 X4.2A X4.2B X4.4 X4.4A X4.4B ; port TAPE_IN
NetC52_2: X6.4 X6.4A X6.4B X8.6(AUDIO_L/MONO_IN) ; port LEFT
NetC53_2: X6.2 X6.2A X6.2B X8.2(AUDIO_R_IN) ; port RIGHT
NetD4_2: J8.1 SYNC.1 ; port SYNC
NetD10_1: D10.1(A) P1.16 ; port KA8
NetD11_1: D11.1(A) P1.14 ; port KA9
NetD12_1: D12.1(A) P1.12 ; port KA10
NetD13_1: D13.1(A) P1.10 ; port KA11
NetD14_1: D14.1(A) P1.8 ; port KA12
NetD15_1: D15.1(A) P1.6 ; port KA13
NetD16_1: D16.1(A) P1.4 ; port KA14
NetD17_1: D17.1(A) P1.2 ; port KA15
NetG_1: G.1 X8.11(GREEN) ; port G
NetJ5_1: J5.1 R63.2
NetJ5_2: J5.2 X8.16(BLANKING)
NetJ8_2: J8.2 X8.20(VIDEO+SYNC_IN)
NetJ8_3: J8.3 VIDEO.1 ; port VIDEO
NetQ1_2: SND.1 ; port SND
NetR_1: R.1 X8.15(RED) ; port R
NetU43_27: X2.1 X3.2(D-) ; port DAT
NetU43_28: X2.5 X3.3(D+) ; port CLK
NetX4_3: X4.3 X4.3A X4.3B
NetX4_5: X4.5 X4.5A X4.5B
NetX5_3: X5.3 X5.3A X5.3B
NetX5_5: X5.5 X5.5A X5.5B
NetX6_3: X6.3 X6.3A X6.3B
NetX6_5: X6.5 X6.5A X6.5B

Not connected (* = marked no-connect by the designer): P1 11 13 15; X2 2 6; X8 1(AUDIO_R_OUT) 3(AUDIO_L/MONO_OUT) 8(SWITCHING) 10(COMMS_DATA_2) 12(COMMS_DATA_1) 19(VIDEO+SYNC_OUT)

### Library data of the parts
B G R RESET_BTN2 RST SND SYNC VIDEO = Socket: LatestRevisionDate: 17-Jul-2002; LatestRevisionNote: Re-released for DXP Platform.; Publisher: Altium Limited
D10-D17 = Diode 1N4148: High Conductance Fast Diode; Published: 8-Jun-2000; LatestRevisionDate: 17-Jul-2002; LatestRevisionNote: Re-released for DXP Platform.; DatasheetVersion: 1997; PackageReference: DO-35; Publisher: Altium Limited; PackageDescription: Diode, Axial; Body 3.8 x 1.9 mm (LxDia. max), Lead Dia. 0.53 mm (max); Code_JEDEC: DO-204-AH; ComponentLink1Description: Manufacturer Link; ComponentLink1URL: http://www.fairchildsemi.com/; ComponentLink2Description: Datasheet; ComponentLink2URL: http://www.fairchildsemi.com/ds/1N%2F1N4148.pdf
P1 = Header 8X2: Header, 8-Pin, Dual row; LatestRevisionDate: 17-Jul-2002; LatestRevisionNote: Re-released for DXP Platform.; Publisher: Altium Limited
R63 = Res2: Resistor; Published: 8-Jun-2000; LatestRevisionDate: 17-Jul-2002; LatestRevisionNote: Re-released for DXP Platform.; PackageReference: AXIAL-0.4; Publisher: Altium Limited; PackageDescription: Axial Device, Thru-Hole; 2 Leads; 0.4 in Pin Spacing
X1 = PWR2.5: Low Voltage Power Supply Connector; Published: 17-Dec-2003; DatasheetDocument: 09-May-2002; Publisher: Altium Limited; ComponentLink1Description: Manufacturer Link; ComponentLink1URL: http://domino.kycon.com/internet/Products.html
X2 = PS2-6PIN: 6 Pin Through Hole PS2 Socket (Kycon P/N); Published: 17-Dec-2003; Publisher: Altium Limited; ComponentLink1Description: Manufacturer Link; ComponentLink1URL: http://www.oupiin.com/prodindx.html#Headers
X3 = 787761-1: USB 1.1, Right Angle, Thru-Hole, A Type, Receptacle, 4 Position, Black; ContactMaterial: Copper Alloy; ContactPlating: Gold Flash over Palladium Nickel or Gold (30) over Nickel; TerminationLength: 2.84mm [0.112in.]; PCB_Layout: Complies with manufacturer's recommendation.; DrillSize: Corresponds to nominal value.; PanelGround: Without; Published: 15-Jul-2004; DatasheetDocument: 11-Jan-2004; PackageDocument: 11-Jan-2004; PackageReference: 787761; Publisher: Altium Limited; HousingMaterial: Thermoplastic; ComponentLink1Description: Manufacturer Link; ComponentLink1URL: http://www.tycoelectronics.com/; ComponentLink2Description: Packaging Specification; ComponentLink2URL: http://ecommas.tycoelectronics.com/commerce/DocumentDelivery/DDEController?Action=showdoc&DocId=Customer+Drawing%7F787761%7FH%7Ftif%7FEnglish%7FENG_CD_787761_H.tif
X4-X6 = Phonejack Stereo SW: 3-Conductor Jack with 2 break contacts (normals) and 2 auxiliary make contacts; Published: 5-Jan-2004; LatestRevisionDate: 17-Dec-2003; LatestRevisionNote: PCB Footprint replaced.; DatasheetDocument: 07-Mar-2000; Publisher: Altium Limited; ComponentLink1Description: Manufacturer Link; ComponentLink1URL: http://domino.kycon.com/internet/Products.html
X7 = Header 5: Header, 5-Pin; LatestRevisionDate: 17-Jul-2002; LatestRevisionNote: Re-released for DXP Platform.; Publisher: Altium Limited
BTN1 BTN2 = Socket: LatestRevisionDate: 17-Jul-2002; LatestRevisionNote: Re-released for DXP Platform.; Publisher: Altium Limited

## Nets that join several sheets
GND: ClockGenerator (31 pins), ControlSignal (20 pins), VideoControl (20 pins), VideoSignal (21 pins), CPU_ROM (10 pins), MemoryControl (25 pins), RAM (24 pins), Keyboard (U43.8 U43.22), AudioAY (7 pins), Interface (12 pins), Connectors (30 pins)
VCC: ClockGenerator (26 pins), ControlSignal (21 pins), VideoControl (22 pins), VideoSignal (18 pins), CPU_ROM (21 pins), MemoryControl (22 pins), RAM (16 pins), Keyboard (R52.2 U43.7), AudioAY (7 pins), Interface (20 pins), Connectors (6 pins)
A0: ControlSignal (U49.1 U50.4), CPU_ROM (U20.30 U29.10), MemoryControl (U15.2), Interface (U37.1 U38.1)
A1: CPU_ROM (U20.31 U29.9), MemoryControl (U15.5 U47.2), AudioAY (U53.2)
A2: CPU_ROM (U20.32 U29.8), MemoryControl (U15.11)
A3: CPU_ROM (U20.33 U29.7), MemoryControl (U15.14)
A4: CPU_ROM (U20.34 U29.6), MemoryControl (U16.2)
A5: ControlSignal (U50.5), CPU_ROM (U20.35 U29.5), MemoryControl (U16.5)
A6: CPU_ROM (U20.36 U29.4), MemoryControl (U16.11)
A7: CPU_ROM (U20.37 U29.3), MemoryControl (U16.14)
A8: CPU_ROM (U20.38 U29.25), MemoryControl (U15.3), Connectors (D10.2)
A9: CPU_ROM (U20.39 U29.24 U51.1), MemoryControl (U15.6), Connectors (D11.2)
A10: CPU_ROM (U20.40 U29.21), MemoryControl (U15.10), Connectors (D12.2)
A11: CPU_ROM (U20.1 U29.23), MemoryControl (U15.13), Connectors (D13.2)
A12: CPU_ROM (U20.2 U29.2), MemoryControl (U16.3), Connectors (D14.2)
A13: CPU_ROM (U20.3 U29.26), MemoryControl (U16.6), Connectors (D15.2)
A14: ControlSignal (U10.11), CPU_ROM (U20.4), MemoryControl (J17.1 U46.3 U46.13 U48.4), AudioAY (U48.13), Connectors (D16.2)
A15: ControlSignal (U10.12), CPU_ROM (U20.5), MemoryControl (J18.1 U46.10 U47.3 U48.5), AudioAY (U48.9), Connectors (D17.2)
~{BORDER}: ControlSignal (U13.6 U40.13), VideoSignal (U30.10 U31.10)
BRD0: VideoSignal (U30.3 U30.7), Interface (U39.12)
BRD1: VideoSignal (U30.4 U31.3), Interface (U39.10)
BRD2: VideoSignal (U30.9 U31.4), Interface (U39.7)
~{CAS}: ControlSignal (U13.11), RAM (8 pins)
D0: CPU_ROM (R34.1 U20.14 U29.11 U32.12), MemoryControl (U45.3), RAM (U21.2), AudioAY (U52.28), Interface (U37.4 U39.13)
D1: CPU_ROM (R35.1 U20.15 U29.12 U32.15), MemoryControl (U45.4), RAM (U22.2), AudioAY (U52.27), Interface (U37.7 U39.11)
D2: CPU_ROM (R37.1 U20.12 U29.13 U32.16), MemoryControl (U45.6), RAM (U23.2), AudioAY (U52.26), Interface (U37.9 U39.6)
D3: CPU_ROM (R39.1 U20.8 U29.15 U32.19), MemoryControl (U45.11), RAM (U24.2), AudioAY (U52.25), Interface (U37.12 U39.4)
D4: CPU_ROM (R41.1 U20.7 U29.16 U32.2), MemoryControl (U45.13), RAM (U25.2), AudioAY (U52.24), Interface (U38.4 U39.3)
D5: CPU_ROM (R43.1 U20.9 U29.17 U32.5), MemoryControl (U45.14), RAM (U26.2), AudioAY (U52.23), Interface (U38.7)
D6: CPU_ROM (R47.1 U20.10 U29.18 U32.6), RAM (U27.2), AudioAY (U52.22), Interface (U38.9)
D7: CPU_ROM (R48.1 U20.13 U29.19 U32.9), RAM (U28.2), AudioAY (U52.21), Interface (U38.12)
DV0: Interface (R36.1 U37.3), Connectors (X7.1)
DV1: Interface (R38.1 U37.6), Connectors (X7.2)
DV2: Interface (R40.1 U37.10), Connectors (X7.3)
DV3: Interface (R42.1 U37.13), Connectors (X7.4)
DV4: Interface (R44.1 U38.3), Connectors (X7.5)
H0: ClockGenerator (U2.12 U3.3), ControlSignal (U13.1 U40.2)
H1: ClockGenerator (U3.2), ControlSignal (U34.1 U40.1), MemoryControl (U15.15 U16.15 U49.13), AudioAY (U52.15)
H2: ClockGenerator (U3.6), ControlSignal (U10.6), VideoSignal (U30.11 U31.11), MemoryControl (U14.10 U19.1)
H5: ClockGenerator (U4.2), VideoControl (U34.13 U41.12), MemoryControl (U18.11)
~{H1}: ControlSignal (U9.13 U13.2 U34.2), MemoryControl (U17.15 U18.15)
~{IORD}: ControlSignal (J4.2), Interface (U37.15 U38.15)
KL0: Keyboard (U43.14), Interface (R27.1 U37.2), Connectors (P1.1)
KL1: Keyboard (U43.15), Interface (R28.1 U37.5), Connectors (P1.3)
KL2: Keyboard (U43.16), Interface (R29.1 U37.11), Connectors (P1.5)
KL3: Keyboard (U43.17), Interface (R30.1 U37.14), Connectors (P1.7)
KL4: Keyboard (U43.18), Interface (R33.1 U38.2), Connectors (P1.9)
~{MREQ}: ControlSignal (U10.3 U10.9), CPU_ROM (U20.19)
MA0: MemoryControl (U15.4 U18.4), RAM (8 pins)
MA1: MemoryControl (U15.7 U18.7), RAM (8 pins)
MA2: MemoryControl (U15.9 U18.9), RAM (8 pins)
MA3: MemoryControl (U15.12 U18.12), RAM (8 pins)
MA4: MemoryControl (U16.4 U17.4), RAM (8 pins)
MA5: MemoryControl (U16.7 U17.7), RAM (8 pins)
MA6: MemoryControl (U16.9 U17.9), RAM (8 pins)
MA7: MemoryControl (U16.12 U17.12), RAM (8 pins)
MA8: MemoryControl (U49.11), RAM (8 pins)
MD0: VideoSignal (U30.2 U33.11), CPU_ROM (U32.13), RAM (U21.14)
MD1: VideoSignal (U30.1 U33.12), CPU_ROM (U32.14), RAM (U22.14)
MD2: VideoSignal (U30.5 U33.13), CPU_ROM (U32.17), RAM (U23.14)
MD3: VideoSignal (U30.6 U33.14), CPU_ROM (U32.18), RAM (U24.14)
MD4: VideoSignal (U31.2 U33.3), CPU_ROM (U32.3), RAM (U25.14)
MD5: VideoSignal (U31.1 U33.4), CPU_ROM (U32.4), RAM (U26.14)
MD6: VideoSignal (U31.5 U33.5), CPU_ROM (U32.7), RAM (U27.14)
MD7: VideoSignal (U31.6 U33.6), CPU_ROM (U32.8), RAM (U28.14)
NetB_1: VideoSignal (R10.2), Connectors (B.1 X8.7)
NetBTN1_1: Keyboard (U43.24), Connectors (BTN1.1)
NetBTN2_1: Keyboard (U43.25), Connectors (BTN2.1)
NetC1_1: CPU_ROM (C1.1 R5.2 U20.26), MemoryControl (U45.1), Keyboard (U43.23), AudioAY (U52.16), Connectors (RST.1)
NetC10_2: ClockGenerator (C10.2 U4.12), VideoControl (U8.3 U14.4)
NetC11_1: ClockGenerator (C11.1 U5.11 U6.11), VideoControl (U8.11 U12.8)
NetC12_2: ClockGenerator (C12.2 U5.5), ControlSignal (U13.5), VideoControl (U8.5)
NetC24_1: Interface (C24.1), Connectors (6 pins)
NetC46_1: Interface (C46.1), Connectors (6 pins)
NetC52_2: AudioAY (C52.2), Connectors (X6.4 X6.4A X6.4B X8.6)
NetC53_2: AudioAY (C53.2), Connectors (X6.2 X6.2A X6.2B X8.2)
NetD2_2: VideoControl (U7.11), VideoSignal (D2.2)
NetD4_2: VideoControl (U11.6), VideoSignal (D4.2), Connectors (J8.1 SYNC.1)
NetD10_1: Keyboard (U43.2), Connectors (D10.1 P1.16)
NetD11_1: Keyboard (U43.3), Connectors (D11.1 P1.14)
NetD12_1: Keyboard (U43.26), Connectors (D12.1 P1.12)
NetD13_1: Keyboard (U43.5), Connectors (D13.1 P1.10)
NetD14_1: Keyboard (U43.6), Connectors (D14.1 P1.8)
NetD15_1: Keyboard (U43.11), Connectors (D15.1 P1.6)
NetD16_1: Keyboard (U43.12), Connectors (D16.1 P1.4)
NetD17_1: Keyboard (U43.13), Connectors (D17.1 P1.2)
NetG_1: VideoSignal (R12.2), Connectors (G.1 X8.11)
NetJ6_2: ControlSignal (J6.2), Interface (U39.9)
NetJ8_3: VideoSignal (R13.2), Connectors (J8.3 VIDEO.1)
NetJ11_1: ControlSignal (U13.3 U34.3), CPU_ROM (J11.1)
NetJ14_2: ControlSignal (U14.1 U14.13), CPU_ROM (J14.2), MemoryControl (U47.6), AudioAY (U53.3)
NetJ27_1: ClockGenerator (U4.7), VideoControl (J27.1), MemoryControl (U17.2)
NetJ28_2: VideoControl (J28.2), VideoSignal (U36.15)
NetQ1_2: Interface (Q1.2), Connectors (SND.1)
NetR25_2: ControlSignal (U34.10), VideoSignal (R25.2)
NetR_1: VideoSignal (R11.2), Connectors (R.1 X8.15)
NetU1_9: ControlSignal (U1.9 U12.6), CPU_ROM (U32.1), Keyboard (U43.4)
NetU1_12: VideoControl (U1.12), CPU_ROM (U20.16)
NetU2_2: ClockGenerator (U2.2 U2.6 U3.5), VideoSignal (U33.2)
NetU2_5: ClockGenerator (U2.5 U2.11), VideoSignal (U35.9)
NetU3_7: ClockGenerator (U3.7), MemoryControl (U18.2)
NetU4_3: ClockGenerator (U4.3), VideoControl (U41.3 U41.11), MemoryControl (U18.5)
NetU4_6: ClockGenerator (U4.6), VideoControl (U34.5), MemoryControl (U18.14)
NetU4_11: ClockGenerator (U4.11), VideoControl (U14.6)
NetU5_2: ClockGenerator (U5.2), MemoryControl (U19.5)
NetU5_3: ClockGenerator (U5.3), MemoryControl (U19.2)
NetU5_6: ClockGenerator (U5.6), VideoControl (U44.1), MemoryControl (U19.11)
NetU5_7: ClockGenerator (U5.7), VideoControl (U44.2), MemoryControl (U17.5)
NetU5_9: ClockGenerator (U5.9 U6.10), ControlSignal (U13.4), VideoControl (U8.9)
NetU6_7: ClockGenerator (U6.7), VideoControl (U12.9), MemoryControl (U19.6 U19.14)
NetU9_2: ControlSignal (U9.2), CPU_ROM (U20.27), AudioAY (U48.12)
NetU9_5: ControlSignal (U9.5), CPU_ROM (U20.24)
NetU12_3: ControlSignal (U12.3 U12.4), CPU_ROM (U29.22)
NetU12_13: ControlSignal (U12.13), CPU_ROM (U20.28)
NetU34_9: CPU_ROM (U34.9 U51.5), MemoryControl (U45.12)
NetU43_27: Keyboard (U43.27), Connectors (X2.1 X3.2)
NetU43_28: Keyboard (U43.28), Connectors (X2.5 X3.3)
~{RAS}: ClockGenerator (R3.1 U2.9 U11.9), CPU_ROM (U20.6), RAM (8 pins)
~{RD}: ControlSignal (U10.8 U12.12 U14.2), CPU_ROM (U20.21)
RAS: ClockGenerator (U11.8), ControlSignal (U9.11), MemoryControl (U15.1 U16.1 U17.1 U18.1)
V4: ClockGenerator (U6.3), VideoControl (U40.5 U44.3), MemoryControl (U17.11)
V5: ClockGenerator (U6.2), VideoControl (U40.4 U44.4), MemoryControl (U17.14)
V6: ClockGenerator (U6.6), VideoControl (U12.10 U13.9 U44.5), MemoryControl (U14.9 U19.3)
~{WE}: ControlSignal (J7.2), RAM (8 pins)
~{WR}: ControlSignal (U14.12), CPU_ROM (U20.22), MemoryControl (U47.5), AudioAY (U53.5)
~{WRBUF}: ControlSignal (U9.4 U13.12 U34.4), CPU_ROM (J11.3)